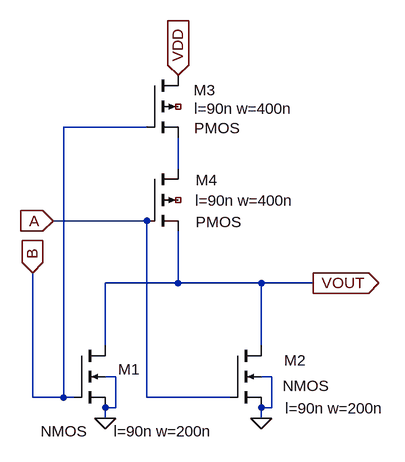
[diagram p0: schematic NOR.asc]
NOR.asc, the LTspice schematic file:
Version 4
SHEET 1 880 680
WIRE 272 -224 144 -224
WIRE 320 -160 320 -208
WIRE 272 -80 128 -80
WIRE 320 16 320 -64
WIRE 320 16 208 16
WIRE 448 16 320 16
WIRE 528 16 448 16
WIRE 208 112 208 16
WIRE 448 112 448 16
WIRE 224 160 208 160
WIRE 464 160 448 160
WIRE 96 192 96 0
WIRE 144 192 144 -224
WIRE 144 192 96 192
WIRE 160 192 144 192
WIRE 272 192 272 -80
WIRE 400 192 272 192
WIRE 224 208 224 160
WIRE 224 208 208 208
WIRE 464 208 464 160
WIRE 464 208 448 208
WIRE 208 224 208 208
WIRE 448 224 448 208
FLAG 208 224 0
FLAG 448 224 0
FLAG 128 -80 A
IOPIN 128 -80 In
FLAG 96 0 B
IOPIN 96 0 In
FLAG 528 16 VOUT
IOPIN 528 16 Out
FLAG 320 -304 VDD
IOPIN 320 -304 In
SYMBOL nmos4 160 112 R0
WINDOW 123 61 132 Left 2
WINDOW 0 68 37 Left 2
WINDOW 3 -51 132 Left 2
SYMATTR Value2 l=90n w=200n
SYMATTR InstName M1
SYMBOL nmos4 400 112 R0
WINDOW 123 85 97 Left 2
WINDOW 0 83 23 Left 2
WINDOW 3 81 62 Left 2
SYMATTR Value2 l=90n w=200n
SYMATTR InstName M2
SYMBOL pmos4 272 -304 R0
WINDOW 123 73 51 Left 2
WINDOW 0 72 23 Left 2
WINDOW 3 73 81 Left 2
SYMATTR Value2 l=90n w=400n
SYMATTR InstName M3
SYMBOL pmos4 272 -160 R0
WINDOW 123 74 49 Left 2
WINDOW 0 75 17 Left 2
WINDOW 3 75 82 Left 2
SYMATTR Value2 l=90n w=400n
SYMATTR InstName M4

The netlist it stands for:
* NOR.asc
M1 VOUT B 0 0 NMOS l=90n w=200n
M2 VOUT A 0 0 NMOS l=90n w=200n
M3 VDD B N001 NC_01 PMOS l=90n w=400n
M4 N001 A VOUT NC_02 PMOS l=90n w=400n
.model NMOS NMOS
.model PMOS PMOS
.lib standard.mos
.backanno
.end